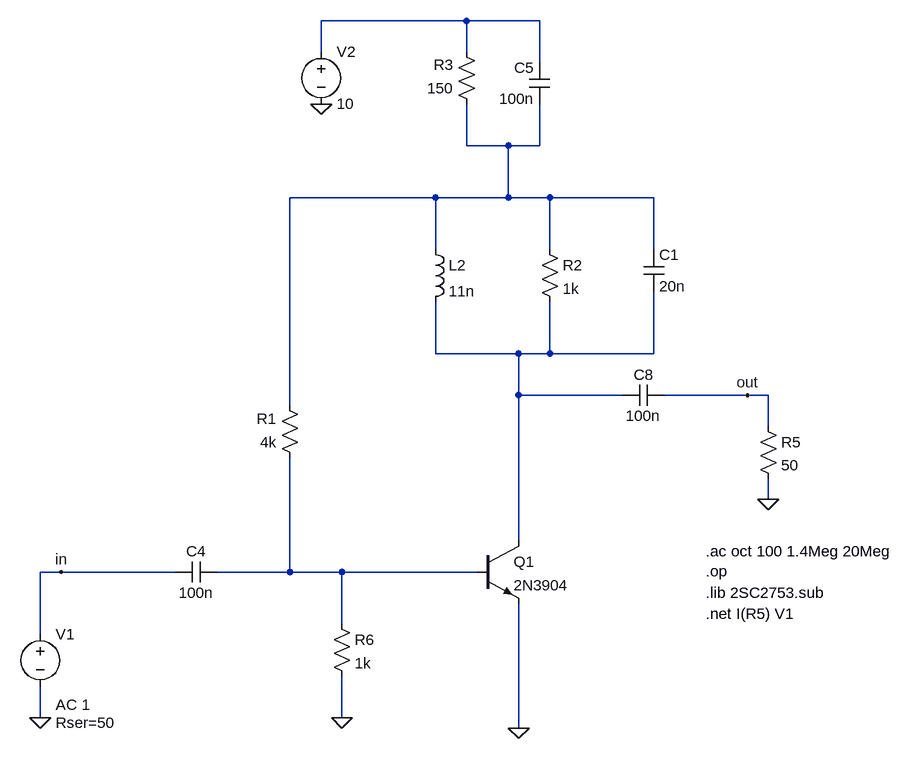
[diagram p0: schematic IFnarrowband.asc]
IFnarrowband.asc, the LTspice schematic file:
Version 4
SHEET 1 1396 692
WIRE 176 -576 -48 -576
WIRE 288 -576 176 -576
WIRE -48 -528 -48 -576
WIRE 176 -528 176 -576
WIRE 288 -512 288 -576
WIRE 176 -384 176 -448
WIRE 240 -384 176 -384
WIRE 288 -384 288 -448
WIRE 288 -384 240 -384
WIRE 128 -304 -96 -304
WIRE 240 -304 240 -384
WIRE 240 -304 128 -304
WIRE 304 -304 240 -304
WIRE 464 -304 304 -304
WIRE 128 -224 128 -304
WIRE 304 -224 304 -304
WIRE 464 -224 464 -304
WIRE 128 -64 128 -144
WIRE 256 -64 128 -64
WIRE 304 -64 304 -144
WIRE 304 -64 256 -64
WIRE 464 -64 464 -160
WIRE 464 -64 304 -64
WIRE 256 0 256 -64
WIRE 416 0 256 0
WIRE 608 0 480 0
WIRE 640 0 608 0
WIRE -96 16 -96 -304
WIRE 640 48 640 0
WIRE 640 160 640 128
WIRE 256 224 256 0
WIRE -448 272 -480 272
WIRE -272 272 -448 272
WIRE -96 272 -96 96
WIRE -96 272 -208 272
WIRE -16 272 -96 272
WIRE 192 272 -16 272
WIRE -16 352 -16 272
WIRE -480 368 -480 272
WIRE -480 496 -480 448
WIRE -16 496 -16 432
WIRE 256 512 256 320
FLAG -480 496 0
FLAG -16 496 0
FLAG 608 0 out
FLAG -448 272 in
FLAG 640 160 0
FLAG 256 512 0
FLAG -48 -448 0
SYMBOL res -32 336 R0
SYMATTR InstName R6
SYMATTR Value 1k
SYMBOL voltage -480 352 R0
WINDOW 123 24 124 Left 2
WINDOW 39 24 152 Left 2
SYMATTR Value2 AC 1
SYMATTR SpiceLine Rser=50
SYMATTR InstName V1
SYMATTR Value ""
SYMBOL res -80 112 R180
WINDOW 0 36 76 Left 2
WINDOW 3 36 40 Left 2
SYMATTR InstName R1
SYMATTR Value 4k
SYMBOL cap 480 -16 R90
WINDOW 0 0 32 VBottom 2
WINDOW 3 32 32 VTop 2
SYMATTR InstName C8
SYMATTR Value 100n
SYMBOL cap -208 256 R90
WINDOW 0 0 32 VBottom 2
WINDOW 3 32 32 VTop 2
SYMATTR InstName C4
SYMATTR Value 100n
SYMBOL res 624 32 R0
SYMATTR InstName R5
SYMATTR Value 50
SYMBOL ind 112 -240 R0
SYMATTR InstName L2
SYMATTR Value 11n
SYMBOL Voltage -48 -544 R0
SYMATTR InstName V2
SYMATTR Value 10
SYMBOL Res 288 -240 R0
SYMATTR InstName R2
SYMATTR Value 1k
SYMBOL Cap 448 -224 R0
SYMATTR InstName C1
SYMATTR Value 20n
SYMBOL res 192 -432 R180
WINDOW 0 36 76 Left 2
WINDOW 3 36 40 Left 2
SYMATTR InstName R3
SYMATTR Value 150
SYMBOL cap 304 -448 R180
WINDOW 0 24 56 Left 2
WINDOW 3 24 8 Left 2
SYMATTR InstName C5
SYMATTR Value 100n
SYMBOL npn 192 224 R0
SYMATTR InstName Q1
SYMATTR Value 2N3904
TEXT 544 240 Left 2 !.ac oct 100 1.4Meg 20Meg\n.op
TEXT 544 304 Left 2 !.lib 2SC2753.sub
TEXT 544 336 Left 2 !.net I(R5) V1

The netlist it stands for:
* IFnarrowband.asc
R6 N004 0 1k
V1 in 0 AC 1 Rser=50
R1 N004 N002 4k
C8 out N003 100n
C4 N004 in 100n
R5 out 0 50
L2 N002 N003 11n
V2 N001 0 10
R2 N002 N003 1k
C1 N002 N003 20n
R3 N002 N001 150
C5 N002 N001 100n
Q1 N003 N004 0 0 2N3904
.model NPN NPN
.model PNP PNP
.lib standard.bjt
.ac oct 100 1.4Meg 20Meg
.op
.lib 2SC2753.sub
.net I(R5) V1
.backanno
.end